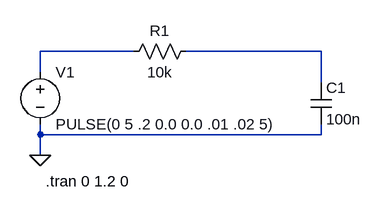
[diagram p0: schematic SimpleRCLowPassFilter.asc]
SimpleRCLowPassFilter.asc, the LTspice schematic file:
Version 4
SHEET 1 880 680
WIRE 160 80 16 80
WIRE 448 80 240 80
WIRE 16 112 16 80
WIRE 448 128 448 80
WIRE 16 208 16 192
WIRE 448 208 448 192
WIRE 448 208 16 208
WIRE 16 240 16 208
FLAG 16 240 0
SYMBOL voltage 16 96 R0
WINDOW 123 0 0 Left 0
WINDOW 39 0 0 Left 0
SYMATTR InstName V1
SYMATTR Value PULSE(0 5 .2 0.0 0.0 .01 .02 5)
SYMBOL res 256 64 R90
WINDOW 0 0 56 VBottom 2
WINDOW 3 32 56 VTop 2
SYMATTR InstName R1
SYMATTR Value 10k
SYMBOL cap 432 128 R0
SYMATTR InstName C1
SYMATTR Value 100n
TEXT 24 280 Left 2 !.tran 0 1.2 0

The netlist it stands for:
* SimpleRCLowPassFilter.asc
V1 N001 0 PULSE(0 5 .2 0.0 0.0 .01 .02 5)
R1 N002 N001 10k
C1 N002 0 100n
.tran 0 1.2 0
.backanno
.end